# Altium schematic sheet Sheet1.SchDoc
size A
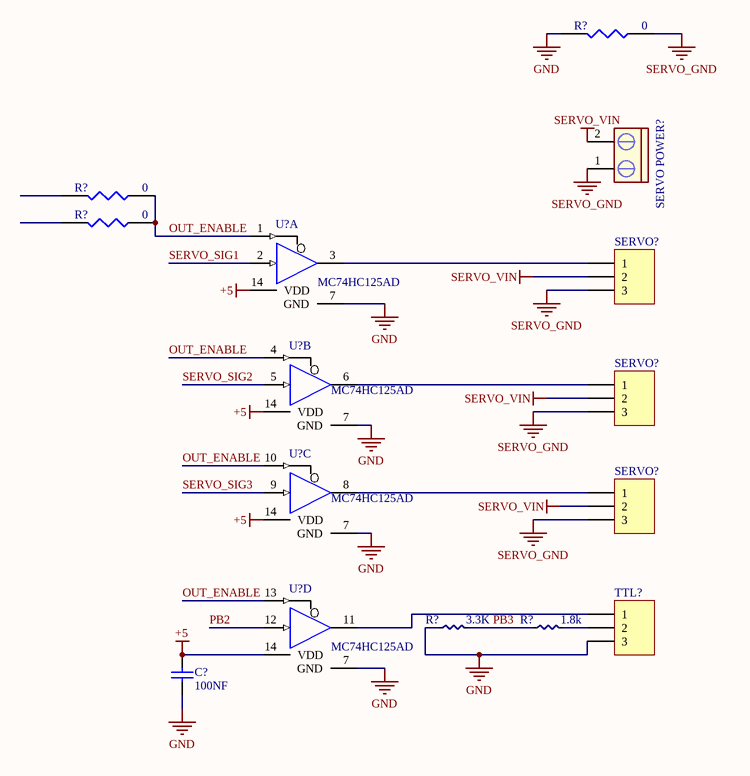
[diagram p0: Sheet1.SchDoc]

## Parts
(Parts that share a designator on the sheet are numbered #1, #2 ... from top to bottom, then left to right.)
C?  100NF  [MY_CAP_SMD_0805]
R?#1  0  [MY_RES_SMD_0805]
R?#2  0  [MY_RES_SMD_0805]
R?#3  0  [MY_RES_SMD_0805]
R?#4  3.3K  [MY_RES_SMD_0805]
R?#5  1.8k  [MY_RES_SMD_0805]
SERVO?#1  Header 3  [My_1X03]  (value not drawn)
SERVO?#2  Header 3  [My_1X03]  (value not drawn)
SERVO?#3  Header 3  [My_1X03]  (value not drawn)
SERVO_POWER?  CON2 pin blue  [My_CN2]  (value not drawn)
TTL?  Header 3  [My_1X03]  (value not drawn)
U?#1  MC74HC125AD  [751A-02_N]  (part A of 4)
U?#2  MC74HC125AD  [751A-02_N]  (part B of 4)
U?#3  MC74HC125AD  [751A-02_N]  (part C of 4)
U?#4  MC74HC125AD  [751A-02_N]  (part D of 4)

## Nets
+5: C?.2 U?#1.14(VDD) U?#2.14(VDD) U?#3.14(VDD) U?#4.14(VDD)
GND: C?.1 R?#1.2 R?#4.1 TTL?.3 U?#1.7(GND) U?#2.7(GND) U?#3.7(GND) U?#4.7(GND)
SERVO_GND: R?#1.1 SERVO?#1.3 SERVO?#2.3 SERVO?#3.3 SERVO_POWER?.1
SERVO_VIN: SERVO?#1.2 SERVO?#2.2 SERVO?#3.2 SERVO_POWER?.2
OUT_ENABLE: R?#2.1 R?#3.1 U?#1.1(~{OE}) U?#2.4(~{OE}) U?#3.10(~{OE}) U?#4.13(~{OE})
PB2: U?#4.12(A)
PB3: R?#4.2 R?#5.1
SERVO_SIG1: U?#1.2(A)
SERVO_SIG2: U?#2.5(A)
SERVO_SIG3: U?#3.9(A)
NetR?#5_2: R?#5.2 TTL?.2
NetSERVO?#1_1: SERVO?#1.1 U?#1.3(Y)
NetSERVO?#2_1: SERVO?#2.1 U?#2.6(Y)
NetSERVO?#3_1: SERVO?#3.1 U?#3.8(Y)
NetTTL?_1: TTL?.1 U?#4.11(Y)

Not connected (* = marked no-connect by the designer): R?#2 2; R?#3 2

## Library data of the parts
C? = CAP SMD_0805: 2.0 mm × 1.25 mm
R?#1-R?#3 = RES SMD
R?#4 R?#5 = RES SMD 0805
SERVO?#1-SERVO?#3 TTL? = Header 3: Header, 3-Pin; LatestRevisionDate: 17-Jul-2002; LatestRevisionNote: Re-released for DXP Platform.; Publisher: Altium Limited
SERVO_POWER? = CON2 pin blue: Connector blue screw
U?#1-U?#4 = MC74HC125AD: Quad 3-State Non-Inverting Buffer; Published: 17-Jul-2002; LatestRevisionDate: 13-Apr-2006; LatestRevisionNote: IPC-7351 Footprint Added.; DatasheetVersion: 1989; PackageVersion: 1991; PackageReference: 751A-02; Publisher: Altium Limited; PackageDescription: 14-Pin Small Outline Integrated Circuit 1.27 mm Pitch; Code_IPC: SOIC127P600-14; ComponentLink1Description: Manufacturer Link; ComponentLink1URL: http://www.onsemi.com/site/products/parametrics/0,4446,178,00.html